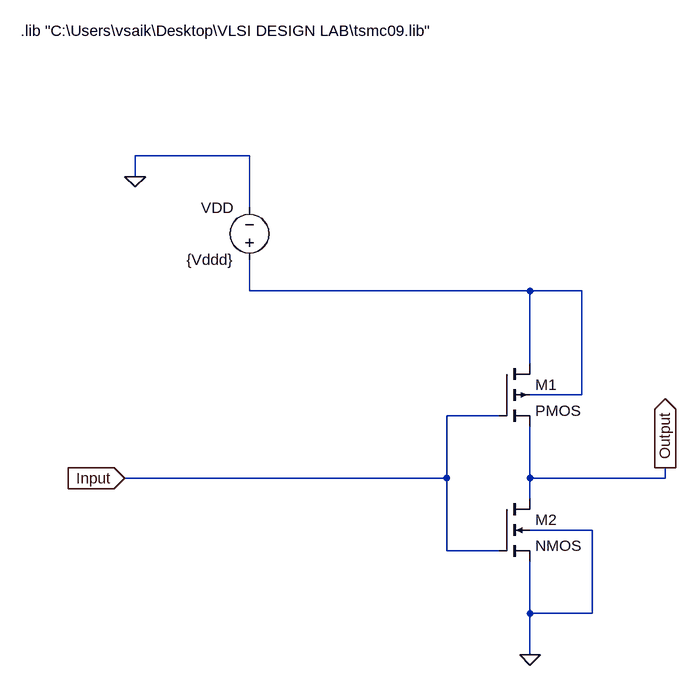
[diagram p0: schematic NOT_model1.asc]
NOT_model1.asc, the LTspice schematic file:
Version 4
SHEET 1 888 680
WIRE -208 -304 -384 -304
WIRE -384 -272 -384 -304
WIRE -208 -224 -208 -304
WIRE -208 -96 -208 -144
WIRE 224 -96 -208 -96
WIRE 304 -96 224 -96
WIRE 224 16 224 -96
WIRE 304 64 304 -96
WIRE 304 64 224 64
WIRE 176 96 96 96
WIRE 96 192 96 96
WIRE 96 192 -400 192
WIRE 224 192 224 112
WIRE 432 192 432 176
WIRE 432 192 224 192
WIRE 224 224 224 192
WIRE 320 272 224 272
WIRE 96 304 96 192
WIRE 176 304 96 304
WIRE 224 400 224 320
WIRE 320 400 320 272
WIRE 320 400 224 400
WIRE 224 464 224 400
FLAG -384 -272 0
FLAG 224 464 0
FLAG -400 192 Input
IOPIN -400 192 In
FLAG 432 176 Output
IOPIN 432 176 Out
SYMBOL voltage -208 -128 R180
WINDOW 0 24 96 Left 2
WINDOW 3 24 16 Left 2
WINDOW 123 0 0 Left 0
WINDOW 39 0 0 Left 0
SYMATTR InstName VDD
SYMATTR Value {Vddd}
SYMBOL pmos4 176 16 R0
SYMATTR InstName M1
SYMATTR Value2 l=90n w=440n
SYMBOL nmos4 176 224 R0
SYMATTR InstName M2
SYMATTR Value2 l=90n w=220n
TEXT -560 -496 Left 2 !.lib "C:\\Users\\vsaik\\Desktop\\VLSI DESIGN LAB\\tsmc09.lib"

The netlist it stands for:
* NOT_model1.asc
VDD N001 0 {Vddd}
M1 N001 Input Output N001 PMOS l=90n w=440n
M2 Output Input 0 0 NMOS l=90n w=220n
.model NMOS NMOS
.model PMOS PMOS
.lib standard.mos
.lib "C:\Users\vsaik\Desktop\VLSI DESIGN LAB\tsmc09.lib"
.backanno
.end